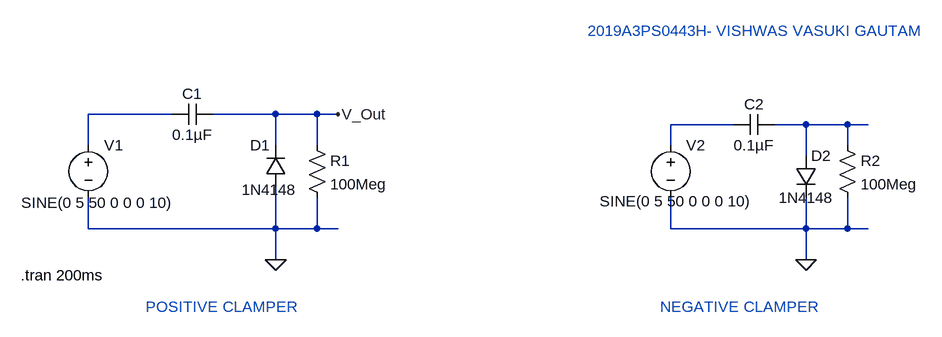
[diagram p0: schematic Clamper_2019A3PS0443H.asc]
Clamper_2019A3PS0443H.asc, the LTspice schematic file:
Version 4
SHEET 1 1044 680
WIRE -128 -448 -256 -448
WIRE 32 -448 -64 -448
WIRE 96 -448 32 -448
WIRE 128 -448 96 -448
WIRE 736 -432 640 -432
WIRE 848 -432 800 -432
WIRE 912 -432 848 -432
WIRE 944 -432 912 -432
WIRE -256 -400 -256 -448
WIRE 32 -400 32 -448
WIRE 96 -400 96 -448
WIRE 640 -400 640 -432
WIRE 912 -400 912 -432
WIRE 848 -384 848 -432
WIRE -256 -272 -256 -320
WIRE 32 -272 32 -336
WIRE 32 -272 -256 -272
WIRE 96 -272 96 -320
WIRE 96 -272 32 -272
WIRE 128 -272 96 -272
WIRE 640 -272 640 -320
WIRE 848 -272 848 -320
WIRE 848 -272 640 -272
WIRE 912 -272 912 -320
WIRE 912 -272 848 -272
WIRE 944 -272 912 -272
WIRE 32 -224 32 -272
WIRE 848 -224 848 -272
FLAG 32 -224 0
FLAG 848 -224 0
FLAG 128 -448 V_Out
SYMBOL voltage -256 -416 R0
WINDOW 3 -103 104 Left 2
WINDOW 123 0 0 Left 0
WINDOW 39 0 0 Left 0
SYMATTR InstName V1
SYMATTR Value SINE(0 5 50 0 0 0 10)
SYMBOL voltage 640 -416 R0
WINDOW 3 -109 102 Left 2
WINDOW 123 0 0 Left 0
WINDOW 39 0 0 Left 0
SYMATTR InstName V2
SYMATTR Value SINE(0 5 50 0 0 0 10)
SYMBOL cap -64 -464 R90
WINDOW 0 0 32 VBottom 2
WINDOW 3 32 32 VTop 2
SYMATTR InstName C1
SYMATTR Value 0.1µF
SYMBOL cap 800 -448 R90
WINDOW 0 0 32 VBottom 2
WINDOW 3 32 32 VTop 2
SYMATTR InstName C2
SYMATTR Value 0.1µF
SYMBOL diode 48 -336 R180
WINDOW 0 24 64 Left 2
WINDOW 3 -17 -4 Left 2
SYMATTR InstName D1
SYMATTR Value 1N4148
SYMBOL res 80 -416 R0
SYMATTR InstName R1
SYMATTR Value 100Meg
SYMBOL diode 832 -384 R0
WINDOW 3 -26 65 Left 2
SYMATTR InstName D2
SYMATTR Value 1N4148
SYMBOL res 896 -416 R0
SYMATTR InstName R2
SYMATTR Value 100Meg
TEXT -360 -200 Left 2 !.tran 200ms
TEXT -168 -152 Left 2 ;POSITIVE CLAMPER
TEXT 624 -152 Left 2 ;NEGATIVE CLAMPER
TEXT 512 -576 Left 2 ;2019A3PS0443H- VISHWAS VASUKI GAUTAM

The netlist it stands for:
* Clamper_2019A3PS0443H.asc
V1 N001 0 SINE(0 5 50 0 0 0 10)
V2 N002 0 SINE(0 5 50 0 0 0 10)
C1 V_Out N001 0.1µF
C2 N003 N002 0.1µF
D1 0 V_Out 1N4148
R1 V_Out 0 100Meg
D2 N003 0 1N4148
R2 N003 0 100Meg
.model D D
.lib standard.dio
.tran 200ms
* POSITIVE CLAMPER
* NEGATIVE CLAMPER
* 2019A3PS0443H- VISHWAS VASUKI GAUTAM
.backanno
.end